# Altium project Hafez_Board.PrjPcb
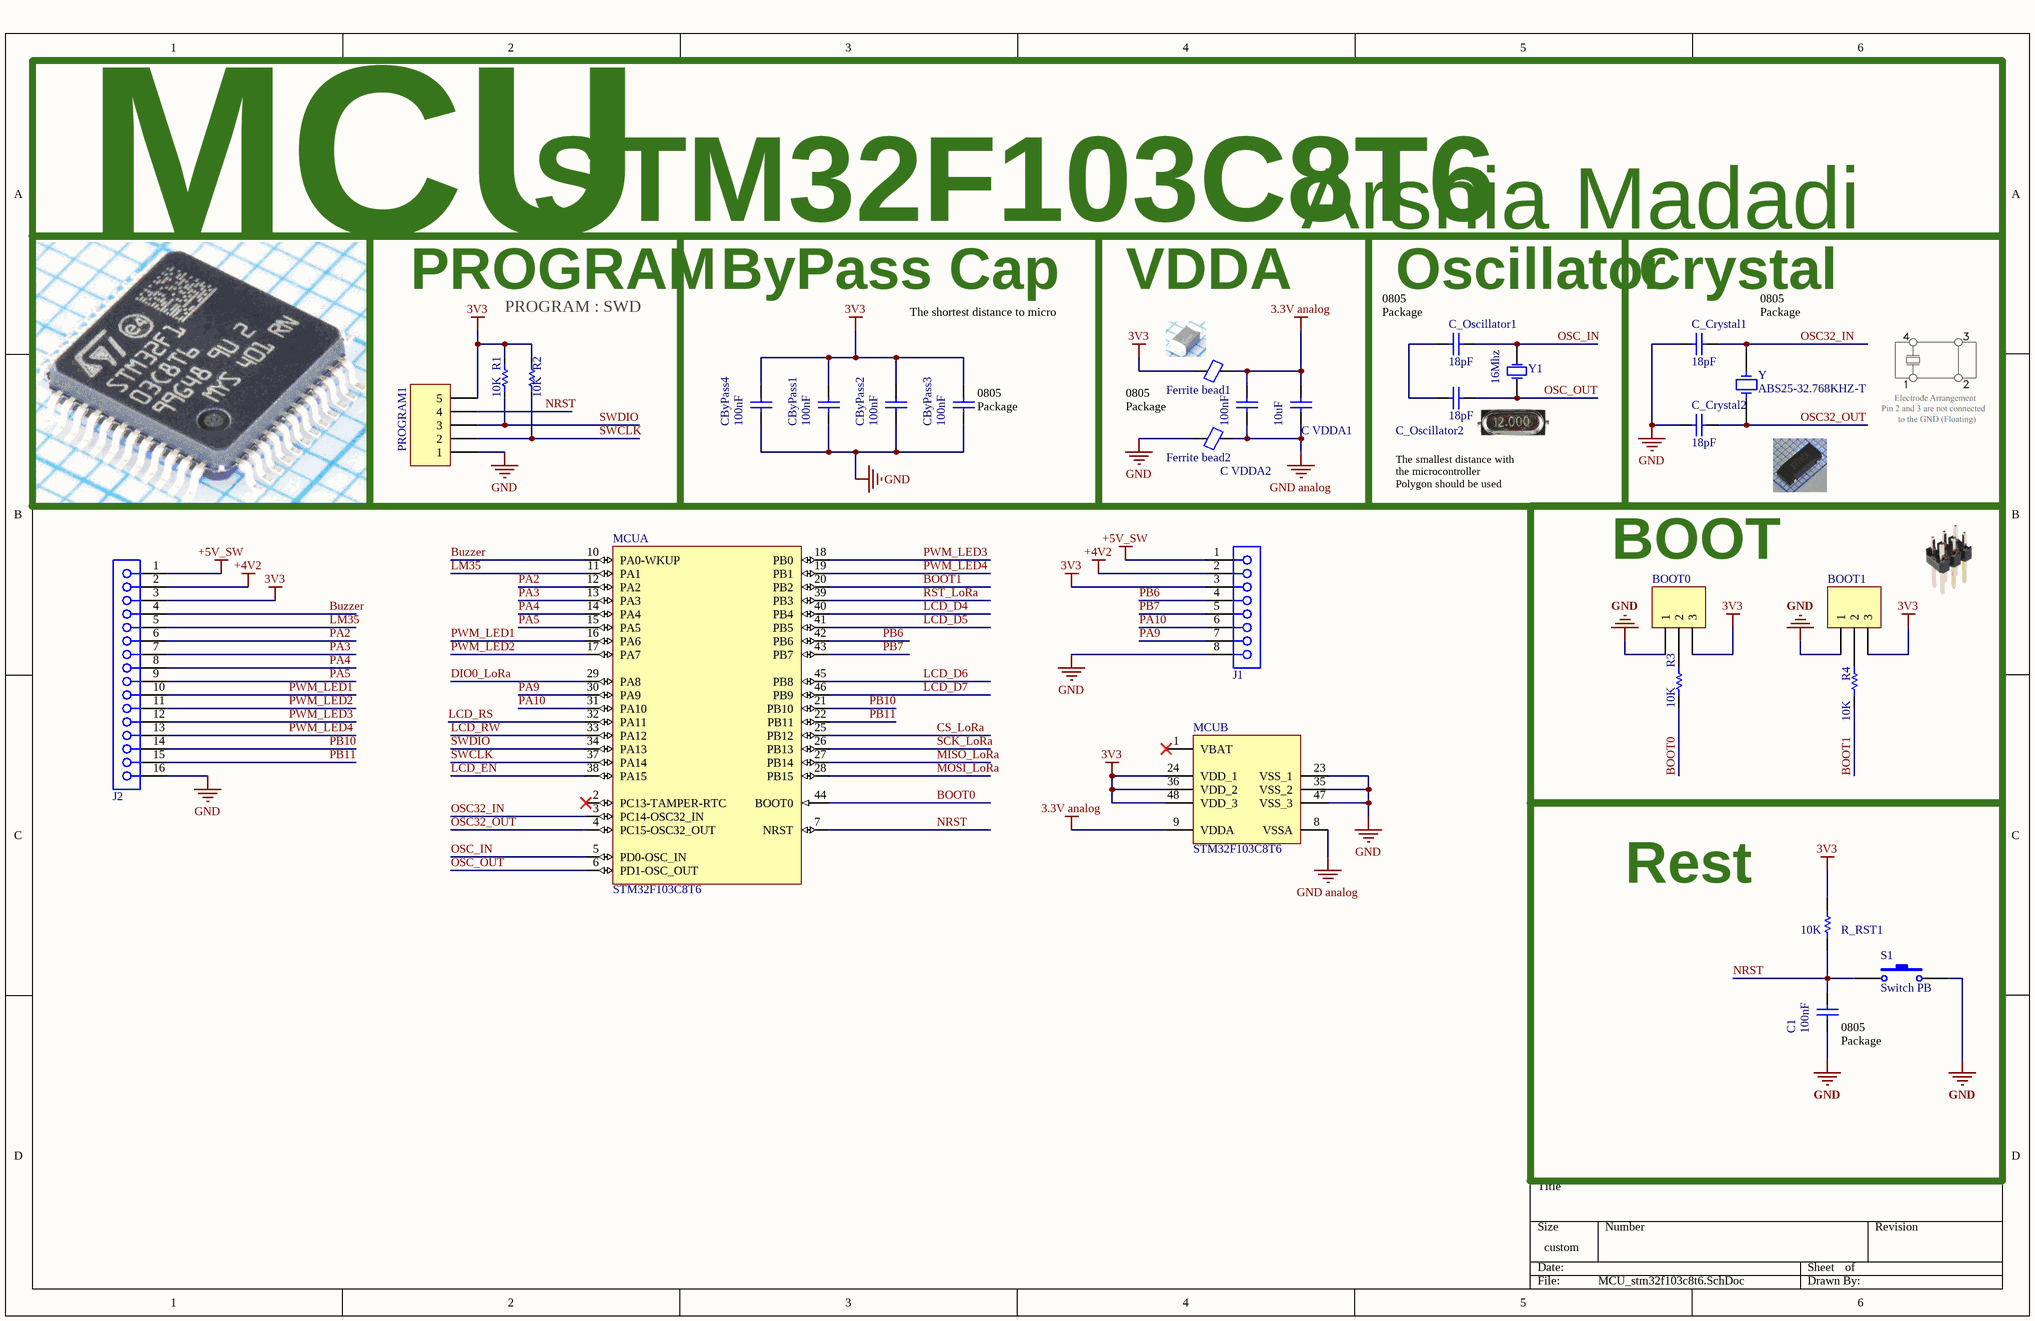
[diagram p0: MCU_stm32f103c8t6.SchDoc]
5 sheets, 81 parts. Net scope: global (net labels, ports and power ports of the same name join across sheets).
Board file: Hafez_PCB.PcbDoc
Sheets:
  MCU_stm32f103c8t6.SchDoc
  Power.SchDoc
  UI.SchDoc
  Communications_Chip.SchDoc
  ADC.SchDoc

## Sheet MCU_stm32f103c8t6.SchDoc
size 381 x 241 mm; SheetNumber: 1; SheetTotal: 5

### Parts
BOOT0  Header 3  [My_1X03]  (value not drawn)
BOOT1  Header 3  [My_1X03]  (value not drawn)
C1  100nF  [MY_CAP_SMD_0805]
C_Crystal1  18pF  [MY_CAP_SMD_0805]
C_Crystal2  18pF  [MY_CAP_SMD_0805]
C_Oscillator1  18pF  [MY_CAP_SMD_0805]
C_Oscillator2  18pF  [MY_CAP_SMD_0805]
C_VDDA1  10uF  [MY_CAP_SMD_0805]
C_VDDA2  100nF  [MY_CAP_SMD_0805]
CByPass1  100nF  [MY_CAP_SMD_0805]
CByPass2  100nF  [MY_CAP_SMD_0805]
CByPass3  100nF  [MY_CAP_SMD_0805]
CByPass4  100nF  [MY_CAP_SMD_0805]
Ferrite_bead1  Ferrite Bead SMD  [FB1206]  (value not drawn)
Ferrite_bead2  Ferrite Bead SMD  [FB1206]  (value not drawn)
J1  61300811821  [61300811821]  (value not drawn)
J2  61301611821  [61301611821]  (value not drawn)
MCU  STM32F103C8T6  [STM-LQFP48_M]  (parts A,B of 2)
PROGRAM1  Header 5  [My_1X05]  (value not drawn)
R1  10K  [1206_Res]
R2  10K  [1206_Res]
R3  10K  [RESC4817X04N]
R4  10K  [RESC4817X04N]
R_RST1  10K  [RESC4817X04N]
S1  Switch PB  [SW-PB]
Y  ABS25-32.768KHZ-T  [XTAL_ABS25-32.768KHZ-6-1-T]
Y1  16Mhz  [Crystal]

### Blocks framed on the sheet
MCU: C_Crystal1 C_Crystal2 C_Oscillator1 C_Oscillator2 C_VDDA1 C_VDDA2 CByPass1-CByPass4 Ferrite_bead1 Ferrite_bead2 PROGRAM1 R1 R2 Y Y1
BOOT: BOOT0 BOOT1 R3 R4
Rest: C1 R_RST1 S1

### Nets
3.3V analog: C_VDDA1.2 C_VDDA2.2 Ferrite_bead1.2 MCU.9(VDDA)
3V3: BOOT0.3 BOOT1.3 CByPass1.2 CByPass2.2 CByPass3.2 CByPass4.2 Ferrite_bead1.1 J1.3 J2.3 MCU.24(VDD_1) MCU.36(VDD_2) MCU.48(VDD_3) PROGRAM1.5 R1.2 R2.2 R_RST1.2
+4V2: J1.2 J2.2
+5V_SW: J1.1 J2.1
GND: BOOT0.1 BOOT1.1 C1.1 C_Crystal1.2 C_Crystal2.2 CByPass1.1 CByPass2.1 CByPass3.1 CByPass4.1 Ferrite_bead2.1 J1.8 J2.16 MCU.23(VSS_1) MCU.35(VSS_2) MCU.47(VSS_3) PROGRAM1.1 S1.2
GND analog: C_VDDA1.1 C_VDDA2.1 Ferrite_bead2.2 MCU.8(VSSA)
BOOT0: MCU.44(BOOT0) R3.1
BOOT1: MCU.20(PB2) R4.1
Buzzer: J2.4 MCU.10(PA0-WKUP)
CS_LoRa: MCU.25(PB12)
DIO0_LoRa: MCU.29(PA8)
LCD_D4: MCU.40(PB4)
LCD_D5: MCU.41(PB5)
LCD_D6: MCU.45(PB8)
LCD_D7: MCU.46(PB9)
LCD_EN: MCU.38(PA15)
LCD_RS: MCU.32(PA11)
LCD_RW: MCU.33(PA12)
LM35: J2.5 MCU.11(PA1)
MISO_LoRa: MCU.27(PB14)
MOSI_LoRa: MCU.28(PB15)
NRST: C1.2 MCU.7(NRST) PROGRAM1.4 R_RST1.1 S1.1
OSC32_IN: C_Crystal1.1 MCU.3(PC14-OSC32_IN) Y.4
OSC32_OUT: C_Crystal2.1 MCU.4(PC15-OSC32_OUT) Y.1
OSC_IN: C_Oscillator1.1 MCU.5(PD0-OSC_IN) Y1.2(OSC2)
OSC_OUT: C_Oscillator2.1 MCU.6(PD1-OSC_OUT) Y1.1(OSC1)
PA2: J2.6 MCU.12(PA2)
PA3: J2.7 MCU.13(PA3)
PA4: J2.8 MCU.14(PA4)
PA5: J2.9 MCU.15(PA5)
PA9: J1.7 MCU.30(PA9)
PA10: J1.6 MCU.31(PA10)
PB6: J1.4 MCU.42(PB6)
PB7: J1.5 MCU.43(PB7)
PB10: J2.14 MCU.21(PB10)
PB11: J2.15 MCU.22(PB11)
PWM_LED1: J2.10 MCU.16(PA6)
PWM_LED2: J2.11 MCU.17(PA7)
PWM_LED3: J2.12 MCU.18(PB0)
PWM_LED4: J2.13 MCU.19(PB1)
RST_LoRa: MCU.39(PB3)
SCK_LoRa: MCU.26(PB13)
SWCLK: MCU.37(PA14) PROGRAM1.2 R2.1
SWDIO: MCU.34(PA13) PROGRAM1.3 R1.1
NetBOOT0_2: BOOT0.2 R3.2
NetBOOT1_2: BOOT1.2 R4.2
NetC_Oscillator1_2: C_Oscillator1.2 C_Oscillator2.2

Not connected (* = marked no-connect by the designer): MCU 1(VBAT)* 2(PC13-TAMPER-RTC)*

### Notes on the sheet
- STM32F103C8T6
- Arshia Madadi
- PROGRAM
- PROGRAM : SWD
- ByPass Cap
- VDDA
- (near C_Oscillator1) 0805 Package
- Oscillator
- (near C_Crystal1) Crystal
- 0805 Package
- The shortest distance to micro
- (near CByPass3) 0805 Package
- The smallest distance with the microcontroller
  Polygon should be used
- (near C1) 0805 Package

### Library data of the parts
BOOT0 BOOT1 = Header 3: Header, 3-Pin; LatestRevisionDate: 17-Jul-2002; LatestRevisionNote: Re-released for DXP Platform.; Publisher: Altium Limited
C1 C_Crystal1 C_Crystal2 C_Oscillator1 C_Oscillator2 C_VDDA1 C_VDDA2 CByPass1-CByPass4 = CAP SMD_0805: 2.0 mm × 1.25 mm
Ferrite_bead1 Ferrite_bead2 = Ferrite Bead SMD Package: Designer: Ali Hafizi
J1 = 61300811821: WR-PHD Socket Header, THT, Vertical, pitch 2.54mm, 1 Row, 8P; Manufacturer: Wurth Elektronik; Contact Resistance: 20mOhm; Rated Current: 3A; Working Voltage: 250V; Withstanding Voltage: 500V; Manufacturer Part Number: 61300811821; Category: Board-to-Board Connectors; Match Code: WR-PHD; ComponentLink1Description: Website Link; ComponentLink1URL: https://www.we-online.com/redexpert/article/61300811821?ad; ComponentLink2Description: Datasheet Link; ComponentLink2URL: https://www.we-online.com/redexpert/spec/61300811821?ad; Mount: Through Hole; Operating Temperature Max: 125°C; Operating Temperature Min: -40°C; Packaging: Tray; Gender: Socket Header; Number of Pins: 8; Number of Rows: 1; Orientation: Vertical; Pitch: 2.54mm
J2 = 61301611821: WR-PHD Socket Header, THT, Vertical, pitch 2.54mm, 1 Row, 16P; Manufacturer: Wurth Elektronik; Contact Resistance: 20mOhm; Rated Current: 3A; Working Voltage: 250V; Withstanding Voltage: 500V; Manufacturer Part Number: 61301611821; Category: Board-to-Board Connectors; Match Code: WR-PHD; ComponentLink1Description: Website Link; ComponentLink1URL: https://www.we-online.com/redexpert/article/61301611821?ad; ComponentLink2Description: Datasheet Link; ComponentLink2URL: https://www.we-online.com/redexpert/spec/61301611821?ad; Mount: Through Hole; Operating Temperature Max: 105°C; Operating Temperature Min: -40°C; Packaging: Tray; Gender: Socket Header; Number of Pins: 16; Number of Rows: 1; Orientation: Vertical; Pitch: 2.54mm
MCU = STM32F103C8T6: ARM Cortex-M3 32-bit MCU, 64 KB Flash, 20 KB Internal RAM, 37 I/Os, 48-pin LQFP, -40 to 85 degC, Tray; A/D Converter: 2x12-bit (10 Channel); FLASH Size (Prog) (kB): 64; I/Os (High Current): 37; Internal RAM Size (kB): 20; Operating Frequency(F) (Processor speed) (MHz): 72; Supply Voltage(Vcc) min (V): 2; DatasheetVersion: Rev. 16; PackageVersion: Rev. 6, 06/2013; PackageReference: LQFP48; PackageDescription: 48-Pin Low Profile Quad Flat Package, 7 x 7 mm Body, 0.5 mm Pitch; Supplier 1: Digi-Key; Supplier Part Number 1: 497-6063-ND; Supplier 2: Farnell; Supplier Part Number 2: 1447637; Supplier 3: Newark; Supplier Part Number 3: 59M2182; Supplier 4: Newark; Supplier Part Number 4: 57P1222; Supplier 5: Mouser; Supplier Part Number 5: 511-STM32F103C8T6; Core: ARM Cortex-M3; Packing: Tray; Mounting Technology: Surface Mount; PartNumber: STM32F103C8T6; ComponentLink1Description: Manufacturer URL; ComponentLink1URL: http://www.st.com/web/en/home.html; ComponentLink2Description: Datasheet; ComponentLink2URL: http://www.st.com/st-web-ui/static/active/en/resource/technical/document/datasheet/CD00161566.pdf; ComponentLink3Description: Package Specification; ComponentLink3URL: http://www.st.com/st-web-ui/static/active/en/resource/technical/document/datasheet/DM00058181.pdf
PROGRAM1 = Header 5: Header, 5-Pin; LatestRevisionDate: 17-Jul-2002; LatestRevisionNote: Re-released for DXP Platform.; Publisher: Altium Limited
R1 R2 = Res: Resistor; Published: 8-Jun-2000; LatestRevisionDate: 17-Jul-2002; LatestRevisionNote: Re-released for DXP Platform.; PackageReference: AXIAL-0.3; Publisher: Altium Limited
R3 R4 R_RST1 = RES 1206 0.25W: RES 1206; Designer: Abbas Basereh; Desc.: RES SMD 1206; Data: 16-12-2016
S1 = Switch PB: Push Button Switch
Y = ABS25-32.768KHZ-T: 32.768kHz Â±20ppm Crystal 12.5pF 50 kOhms 4-SOJ, 5.50mm pitch; MF: Abracon LLC; Package: 4-4 Abracon LLC; MP: ABS25-32.768KHZ; Value: *; Availability: Unavailable; Price: None; SnapEDA_Link: https://www.snapeda.com/parts/ABS25-32.768KHZ/Abracon%20LLC/view-part/478888/?ref=snap
Y1 = XTAL: Crystal Oscillator; Published: 8-Jun-2000; LatestRevisionDate: 17-Jul-2002; LatestRevisionNote: Re-released for DXP Platform.; PackageReference: R38; Publisher: Altium Limited

## Sheet Power.SchDoc
size 381 x 241 mm; SheetNumber: 2; SheetTotal: 4
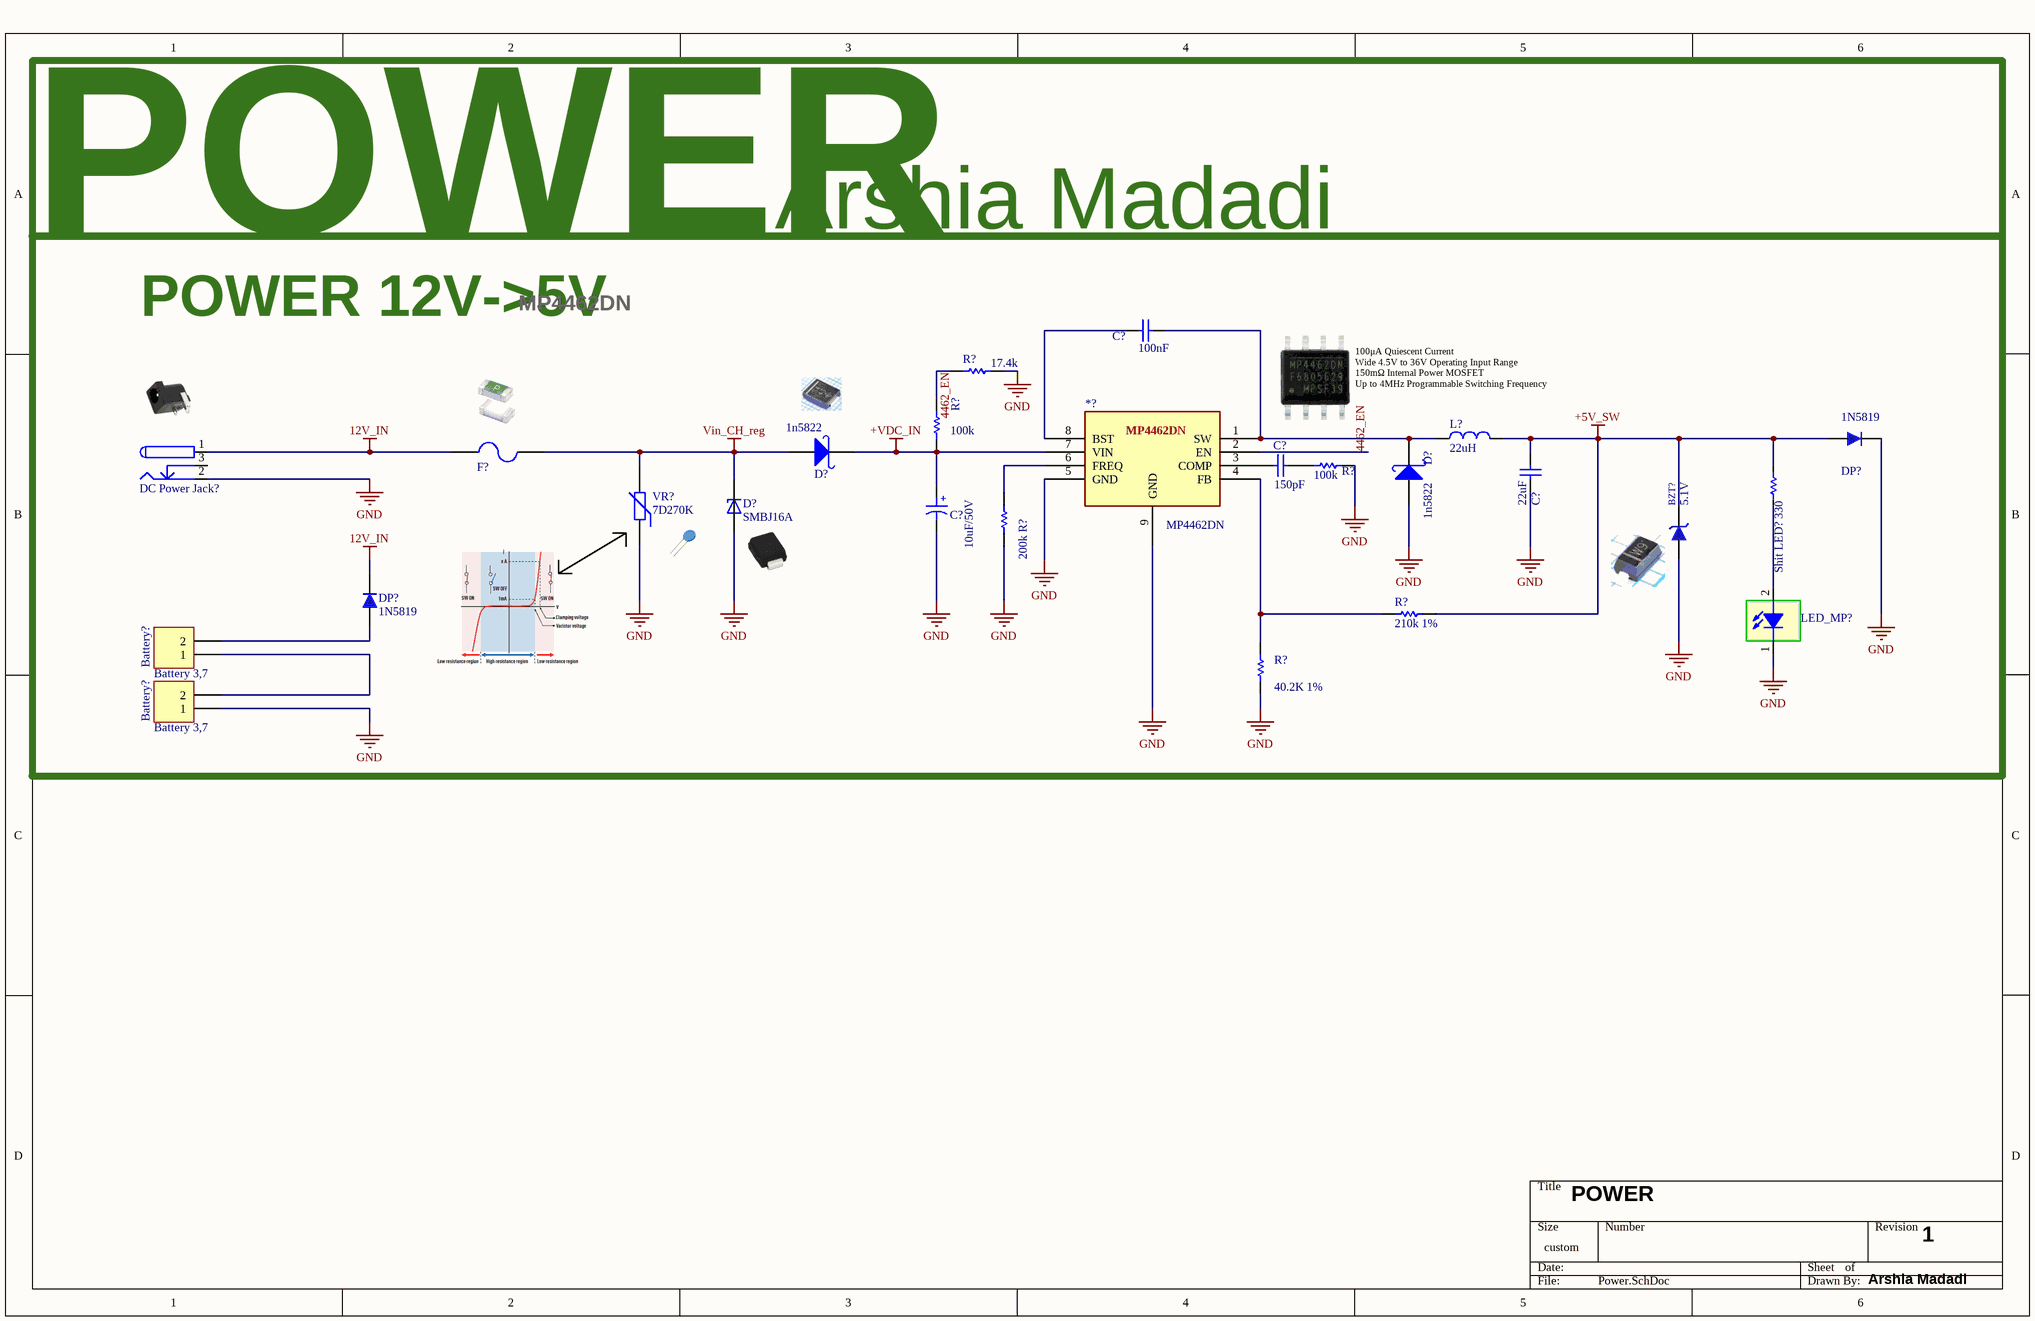
[diagram p1: Power.SchDoc]

### Parts
(Parts that share a designator on the sheet are numbered #1, #2 ... from top to bottom, then left to right.)
*?  MP4462DN  [PCBComponent_1 - duplicate]
Battery?#1  Battery 3,7  [HDR1X2]
Battery?#2  Battery 3,7  [HDR1X2]
BZT?  5.1V  [SOD123]
C?#1  100nF  [CAP1206]
C?#2  150pF  [CAP1206]
C?#3  22uF  [CAP1206]
C?#4  Part. No: 10uF/50V  [Cap electrolitic radial 10x20-5]  (hidden comment: Cap 10x21)
D?#1  1n5822  [DO-214AB(SMC)]
D?#2  1n5822  [DO-214AB(SMC)]
D?#3  SMBJ16A  [DIOM4336X265N]
DC_Power_Jack?  DC Power Jack  [DC Power Jack 1]  (value not drawn)
DP?#1  1N5819  [1n58XX DO-201AD]
DP?#2  1N5819  [1n58XX DO-201AD]
F?  F=3.0 A  [1206 FUSE]  (value not drawn)
L?  value 22uH  [0805 - big]  (hidden comment: 10uH)
LED_MP?  SMD 1206 LED  [LED 1206]  (value not drawn)
R?#1  17.4k  [RESC4817X04N]
R?#2  100k  [RESC4817X04N]
R?#3  100k  [RESC4817X04N]
R?#4  200k  [RESC4817X04N]
R?#5  210k 1%  [RESC4817X04N]
R?#6  40.2K 1%  [RESC4817X04N]
Shit_LED?  330  [1206_Res]
VR?  7D270K  [07D XXX]

### Nets
12V_IN: DC_Power_Jack?.1 DP?#2.2 F?.1
+5V_SW: BZT?.2 C?#3.1 DP?#1.1 L?.2 R?#5.2 Shit_LED?.2
+VDC_IN: *?.7(VIN) C?#4.1 D?#1.2(K) R?#2.2
GND: *?.5(GND) *?.9(GND) Battery?#2.1 BZT?.1 C?#3.2 C?#4.2 D?#2.1(A) D?#3.A DC_Power_Jack?.2 DP?#1.2 LED_MP?.1 R?#1.2 R?#3.2 R?#4.1 R?#6.1 VR?.1
Vin_CH_reg: D?#1.1(A) D?#3.C F?.2 VR?.2
4462_EN: *?.2(EN) R?#1.1 R?#2.1
Net*?_1: *?.1(SW) C?#1.1 D?#2.2(K) L?.1
Net*?_3: *?.3(COMP) C?#2.2
Net*?_4: *?.4(FB) R?#5.1 R?#6.2
Net*?_6: *?.6(FREQ) R?#4.2
Net*?_8: *?.8(BST) C?#1.2
NetBattery?#1_1: Battery?#1.1 Battery?#2.2
NetBattery?#1_2: Battery?#1.2 DP?#2.1
NetC?#2_1: C?#2.1 R?#3.1
NetLED_MP?_2: LED_MP?.2 Shit_LED?.1

Not connected (* = marked no-connect by the designer): DC_Power_Jack? 3

### Notes on the sheet
- Arshia Madadi
- POWER
- POWER 12V->5V
- MP4462DN
- (near L?) 100μA Quiescent Current
  Wide 4.5V to 36V Operating Input Range
  150mΩ Internal Power MOSFET
  Up to 4MHz Programmable Switching Frequency
- 1
- (in symbol Cap electrolitic radial 10x21) +

### Library data of the parts
Battery?#1 Battery?#2 = Header 2: Header, 2-Pin; LatestRevisionDate: 17-Jul-2002; LatestRevisionNote: Re-released for DXP Platform.; Publisher: Altium Limited
BZT? = ZENER GENERAL DIODE: DIODE ZENER GENERAL; VALUE: 12V; Published: 2017-1-12; PackageVersion: 2017-1-12; PackageReference: DO 35; Publisher: Abbas Basereh; PackageDescription: DIODE GEN ZENER; ComponentLink1Description: Manufacturer Link; ComponentLink2Description: Datasheet
C?#1 = CAP SMD PACKAGE: TOTAL CAPACITOR SMD PACK; Designer: Abbas Basereh; Desc.: CAP SMD TOTAL PACKAGES; Data: 2017-3-10; VALUE: 100nF
C?#2 C?#3 = CAP SMD PACKAGE: TOTAL CAPACITOR SMD PACK; Designer: Abbas Basereh; Desc.: CAP SMD TOTAL PACKAGES; VALUE: 100nF; Data: 2017-3-10
C?#4 = Cap electrolitic radial 10x21: Cap electrolitic radial; Designer: Abbas Basereh; Data: 16-12-2016
D?#1 D?#2 = 1N5822 SMD: Schottky Rectifiers; Part. No: SS34; Manufacturer: ON Semiconductor/Fairchild; Designer: Abbas Basereh; Link: https://www.aliexpress.com/item/Free-shipping-100pcs-1n5822-sma-smd-do-214ac-Schottky-diode-ss34/32337482329.html?spm=2114.01010208.3.1.zLZDsP&ws_ab_test=searchweb0_0,searchweb201602_4_10065_10068_10084_10083_10080_10082_10081_10060_10061_10062_10056_10055_10054_10059_10099_10078_10079_427_10073_10103_10102_10096_10052_10050_10051,searchweb201603_4&btsid=6e50dc92-ac69-45bc-a19e-209af19ce602; Link: http://www.tme.eu/en/details/ss34/smd-schottky-diodes/vishay/ss34-e357t/; Link: http://www.digikey.com/product-detail/en/on-semiconductor-fairchild/SS34/SS34FSCT-ND/2094459; Data: 16-12-2016
D?#3 = SMBJ16A: 600W, 18.8V, 5%, Unidirectional, TVS; MF: Taiwan Semiconductor; MP: SMBJ16A; SnapEDA_Link: https://www.snapeda.com/parts/SMBJ16A/Taiwan+Semiconductor/view-part/?ref=snap; Check_prices: https://www.snapeda.com/parts/SMBJ16A/Taiwan+Semiconductor/view-part/?ref=eda; Price: None; Availability: In Stock; Purchase-URL: https://pricing.snapeda.com/search/part/SMBJ16A/?ref=eda; Package: SMD-2-2 Avago; Value: *
DC_Power_Jack? = DC Power Jack: DC Power Jack. Center Pin 2.5mm. Diameter: 5.7mm; Designer: Ali Hafizi; Company: Personal; Project Name: Laser; Adding Date: 10/21/2009
DP?#1 DP?#2 = 1N5819: Schottkey Rectifiers; Designer: Abbas Basereh; Data: 16-12-2016; Link: *; Part. No: *
F? = Fuse SMD1206: SMD Fuses 1206; Designer: Abbas Basereh; Desc.: SMD Fuses 1206; Data: 16-12-2016
L? = Inductor: Code_IEC: 1005; Published: 8-Jun-2000; LatestRevisionDate: 17-Jul-2002; LatestRevisionNote: Re-released for DXP Platform.; PackageReference: 0402-A; Publisher: Altium Limited; Code_JEITA: 0402
LED_MP? = LED SMD 1206
R?#1-R?#6 = RES 1206 0.25W: as R3 on sheet MCU_stm32f103c8t6; Data: 16-12-2016
Shit_LED? = Res: Resistor; Published: 8-Jun-2000; LatestRevisionDate: 17-Jul-2002; LatestRevisionNote: Re-released for DXP Platform.; PackageReference: AXIAL-0.3; Publisher: Altium Limited
VR? = VARISTOR (VDR): VARISTORS; Manufacturer: china-canada-philipina; Designer: Abbas Basereh; VALUE: xxDxxx; Models: MOV-VDR-COV; Data: 2017-1-5; Link: digikey.com; PUBLISHER: ABBAS BASEREH

## Sheet UI.SchDoc
size A; SheetNumber: 3; SheetTotal: 5
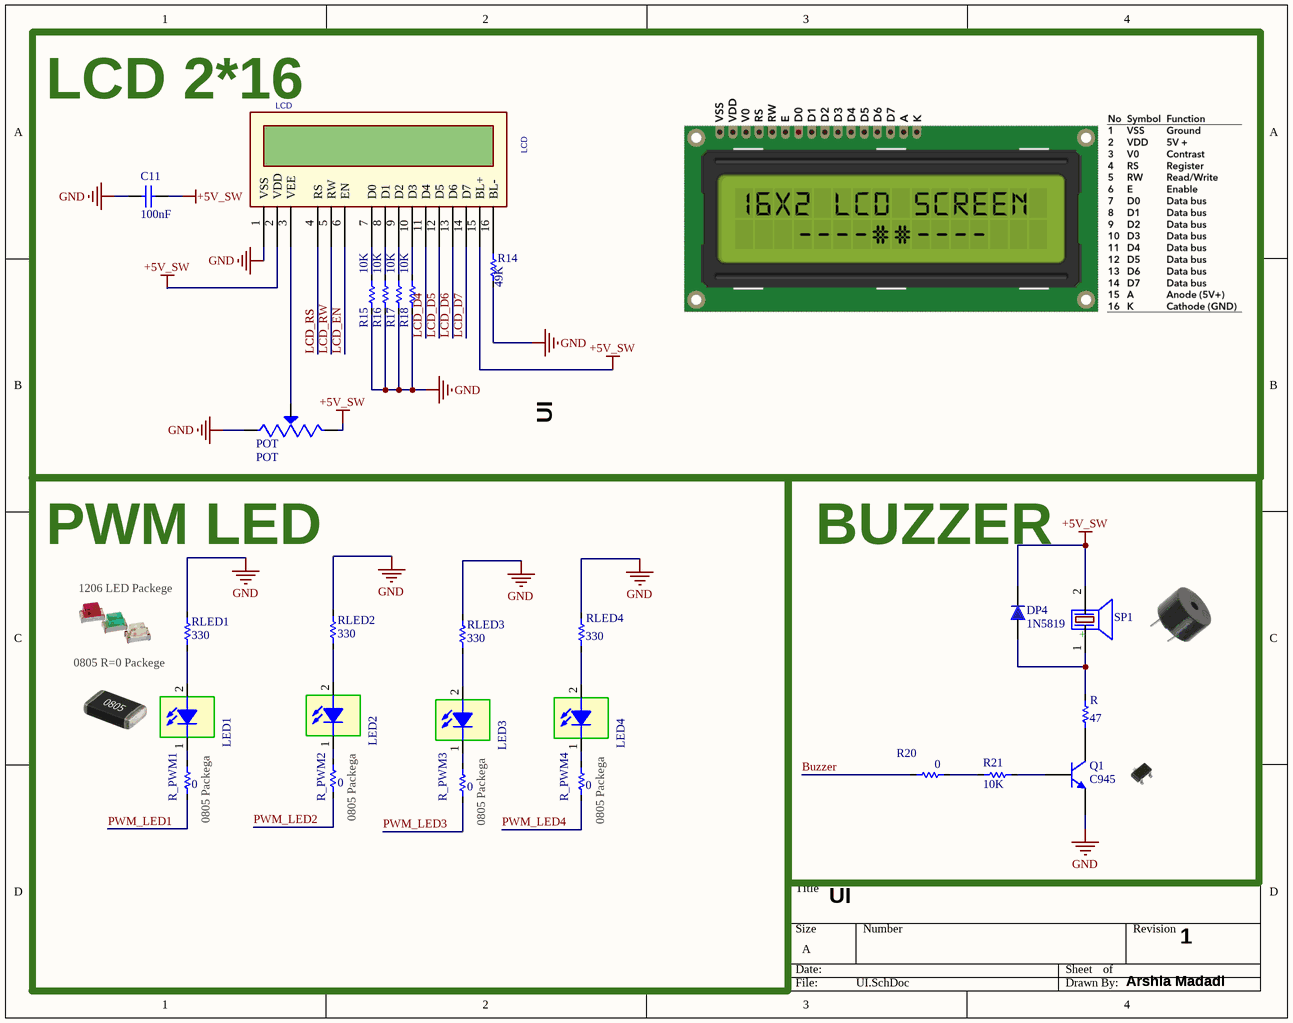
[diagram p2: UI.SchDoc]

### Parts
C11  100nF  [CAPC4817X12N]
DP4  1N5819  [430X270D]
LCD  LCD  [LCD_2X16 BLUE - 2.5mm]
LED1  SMD 1206 LED  [LED 1206]  (value not drawn)
LED2  SMD 1206 LED  [LED 1206]  (value not drawn)
LED3  SMD 1206 LED  [LED 1206]  (value not drawn)
LED4  SMD 1206 LED  [LED 1206]  (value not drawn)
POT  POT  [TRIM_3296W1103LF]
Q1  C945  [SOT23_M]
R  47  [1206_Res]
R14  49K  [1206_Res]
R15  10K  [1206_Res]
R16  10K  [1206_Res]
R17  10K  [1206_Res]
R18  10K  [1206_Res]
R20  0  [0805]
R21  10K  [1206_Res]
R_PWM1  0  [0805]
R_PWM2  0  [0805]
R_PWM3  0  [0805]
R_PWM4  0  [0805]
RLED1  330  [1206_Res]
RLED2  330  [1206_Res]
RLED3  330  [1206_Res]
RLED4  330  [1206_Res]
SP1  (no value)  [BUZZER 7.62mm DC]

### Blocks framed on the sheet
LCD 2*16: C11 LCD POT R14-R18
PWM LED: LED1-LED4 R_PWM1-R_PWM4 RLED1-RLED4
BUZZER: DP4 Q1 R R20 R21 SP1

### Nets
+5V_SW: C11.2 DP4.2 LCD.2(VDD) LCD.15(BL+) POT.3(CW) SP1.2(-)
GND: C11.1 LCD.1(VSS) POT.1(CCW) Q1.2(E) R14.2 R15.1 R16.1 R17.1 R18.1 RLED1.2 RLED2.2 RLED3.2 RLED4.2
Buzzer: R20.2
LCD_D4: LCD.11(D4)
LCD_D5: LCD.12(D5)
LCD_D6: LCD.13(D6)
LCD_D7: LCD.14(D7)
LCD_EN: LCD.6(EN)
LCD_RS: LCD.4(RS)
LCD_RW: LCD.5(RW)
PWM_LED1: R_PWM1.1
PWM_LED2: R_PWM2.1
PWM_LED3: R_PWM3.1
PWM_LED4: R_PWM4.1
NetDP4_1: DP4.1 R.2 SP1.1(+)
NetLCD_3: LCD.3(VEE) POT.2(WIPER)
NetLCD_7: LCD.7(D0) R15.2
NetLCD_8: LCD.8(D1) R16.2
NetLCD_9: LCD.9(D2) R17.2
NetLCD_10: LCD.10(D3) R18.2
NetLCD_16: LCD.16(BL-) R14.1
NetLED1_1: LED1.1 R_PWM1.2
NetLED1_2: LED1.2 RLED1.1
NetLED2_1: LED2.1 R_PWM2.2
NetLED2_2: LED2.2 RLED2.1
NetLED3_1: LED3.1 R_PWM3.2
NetLED3_2: LED3.2 RLED3.1
NetLED4_1: LED4.1 R_PWM4.2
NetLED4_2: LED4.2 RLED4.1
NetQ1_1: Q1.1(B) R21.1
NetQ1_3: Q1.3(C) R.1
NetR20_1: R20.1 R21.2

### Notes on the sheet
- UI
- (near RLED1) 1206 LED Packege
- 0805 R=0 Packege
- 0805 Packega
- 1
- Arshia Madadi

### Library data of the parts
C11 = CAP SMD 1206: CAP 1206; Designer: Abbas Basereh; Desc.: CAP SMD 1206; Data: 16-12-2016
DP4 = 1N5819: as DP?#1 on sheet Power; Data: 16-12-2016; Link: *; Part. No: *
LCD = LCD: Alphanumic LCD; Designer: Abbas Basereh; Data: 16-12-2016
LED1-LED4 = LED SMD 1206
POT = 3296W1103LF: Trimmer, Potentiometer 10kohm 25turn Thd; MF: Bourns; Package: None; MP: 3296W1103LF; Check_prices: https://www.snapeda.com/parts/3296W1103LF/Bourns/view-part/2487625/?ref=eda; Availability: Unavailable; Price: None; Value: *; SnapEDA_Link: https://www.snapeda.com/parts/3296W1103LF/Bourns/view-part/2487625/?ref=snap
Q1 = C945: NPN Silicon Epitaxial Planar Transistor; Published: 2017-2-8; LatestRevisionDate: 2017; LatestRevisionNote: IPC-7351 Footprint Added.; DatasheetVersion: 2017; PackageVersion: 2017-2-8; PackageReference: SOT23; Publisher: Abbas Basereh; PackageDescription: 3-Pin SOT-23 Package 0.95 mm Pitch, 2.3 mm Lead Span; ComponentLink1Description: Manufacturer Link; ComponentLink1URL: http://www.taitroncomponents.com/; ComponentLink2Description: Datasheet; ComponentLink2URL: http://www.taitroncomponents.com/
R R14-R18 R20 R21 R_PWM1-R_PWM4 RLED1-RLED4 = Res: Resistor; Published: 8-Jun-2000; LatestRevisionDate: 17-Jul-2002; LatestRevisionNote: Re-released for DXP Platform.; PackageReference: AXIAL-0.3; Publisher: Altium Limited
SP1 = PIEZO BUZZER: PIEZO BUZZER ACTIVE; Designer: Abbas Basereh; Comment_1: SPEAKER AND BEEP; Design Date: 1395/11/14; ComponentLink2Description: Reference; PackageDescription: THD; Publisher: Abbas Basereh; Mounting Technology: THD; Pin Count: 2; Status: Unreleased

## Sheet Communications_Chip.SchDoc
size A; SheetNumber: 4; SheetTotal: 5
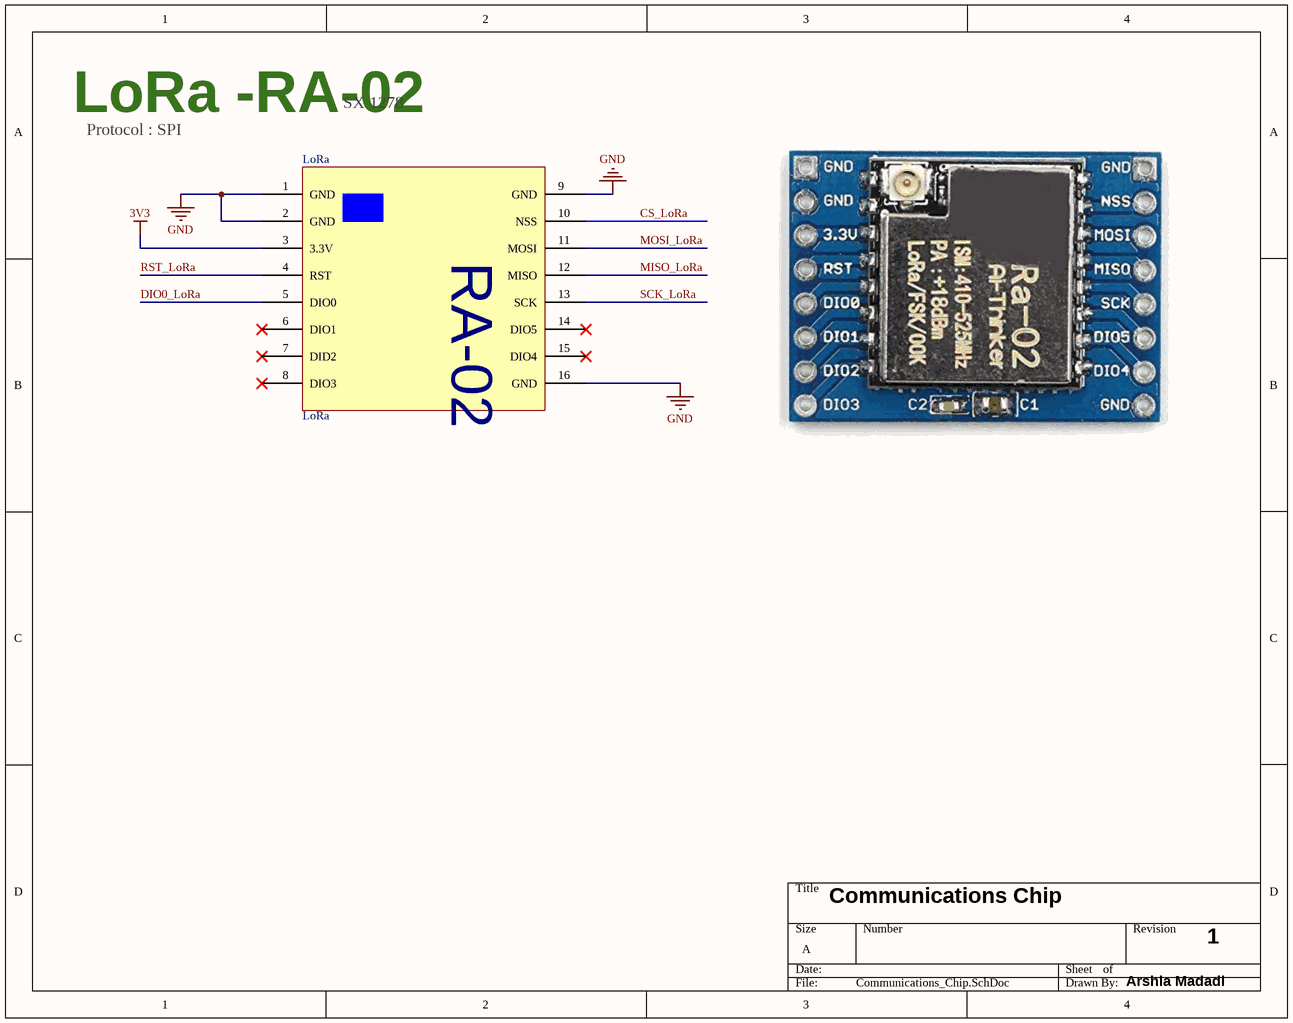
[diagram p3: Communications_Chip.SchDoc]

### Parts
LoRa  LoRa  [PCBComponent_1]

### Nets
3V3: LoRa.3(3.3V)
GND: LoRa.1(GND) LoRa.2(GND) LoRa.9(GND) LoRa.16(GND)
CS_LoRa: LoRa.10(NSS)
DIO0_LoRa: LoRa.5(DIO0)
MISO_LoRa: LoRa.12(MISO)
MOSI_LoRa: LoRa.11(MOSI)
RST_LoRa: LoRa.4(RST)
SCK_LoRa: LoRa.13(SCK)

Not connected (* = marked no-connect by the designer): LoRa 6(DIO1)* 7(DID2)* 8(DIO3)* 14(DIO5)* 15(DIO4)*

### Notes on the sheet
- LoRa -RA-02
- Protocol : SPI
- SX 1278
- Communications Chip
- 1
- Arshia Madadi
- (in symbol LoRa) RA-02

## Sheet ADC.SchDoc
size A; SheetNumber: 5; SheetTotal: 5
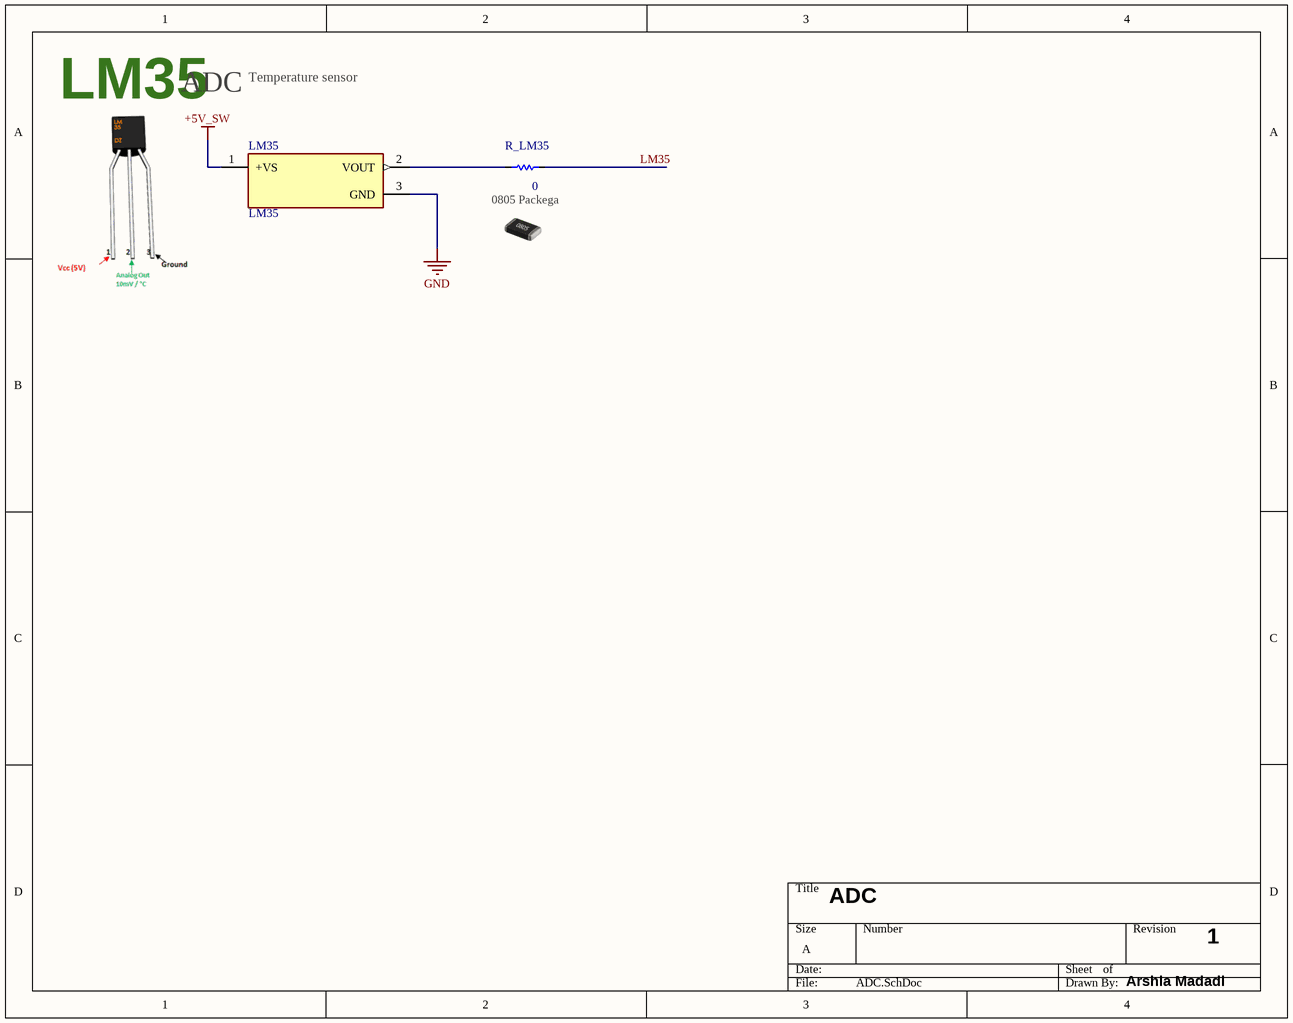
[diagram p4: ADC.SchDoc]

### Parts
LM35  LM35  [TO92127P521H735-3]
R_LM35  0  [0805]

### Nets
+5V_SW: LM35.1(+VS)
GND: LM35.3(GND)
LM35: R_LM35.2
NetLM35_2: LM35.2(VOUT) R_LM35.1

### Notes on the sheet
- ADC
- Temperature sensor
- LM35
- (near R_LM35) 0805 Packega
- 1
- Arshia Madadi

### Library data of the parts
LM35 = LM35DZ/NOPB: Temperature Sensor Analog, Local 0Â°C ~ 100Â°C 10mV/Â°C TO-92-3; MP: LM35DZ; MF: Texas Instruments; Price: None; Availability: In Stock; Package: E-PKG AXIAL-LEADED-2 ON Semiconductor; Value: *; SnapEDA_Link: https://www.snapeda.com/parts/LM35DZ/Texas+Instruments/view-part/?ref=snap; Purchase-URL: https://pricing.snapeda.com/search/part/LM35DZ/?ref=eda; Check_prices: https://www.snapeda.com/parts/LM35DZ/Texas+Instruments/view-part/?ref=eda
R_LM35 = Res: Resistor; Published: 8-Jun-2000; LatestRevisionDate: 17-Jul-2002; LatestRevisionNote: Re-released for DXP Platform.; PackageReference: AXIAL-0.3; Publisher: Altium Limited

## Nets that join several sheets
3V3: MCU_stm32f103c8t6 (16 pins), Communications_Chip (LoRa.3)
+5V_SW: MCU_stm32f103c8t6 (J1.1 J2.1), Power (6 pins), UI (6 pins), ADC (LM35.1)
GND: MCU_stm32f103c8t6 (17 pins), Power (16 pins), UI (13 pins), Communications_Chip (LoRa.1 LoRa.2 LoRa.9 LoRa.16), ADC (LM35.3)
Buzzer: MCU_stm32f103c8t6 (J2.4 MCU.10), UI (R20.2)
CS_LoRa: MCU_stm32f103c8t6 (MCU.25), Communications_Chip (LoRa.10)
DIO0_LoRa: MCU_stm32f103c8t6 (MCU.29), Communications_Chip (LoRa.5)
LCD_D4: MCU_stm32f103c8t6 (MCU.40), UI (LCD.11)
LCD_D5: MCU_stm32f103c8t6 (MCU.41), UI (LCD.12)
LCD_D6: MCU_stm32f103c8t6 (MCU.45), UI (LCD.13)
LCD_D7: MCU_stm32f103c8t6 (MCU.46), UI (LCD.14)
LCD_EN: MCU_stm32f103c8t6 (MCU.38), UI (LCD.6)
LCD_RS: MCU_stm32f103c8t6 (MCU.32), UI (LCD.4)
LCD_RW: MCU_stm32f103c8t6 (MCU.33), UI (LCD.5)
LM35: MCU_stm32f103c8t6 (J2.5 MCU.11), ADC (R_LM35.2)
MISO_LoRa: MCU_stm32f103c8t6 (MCU.27), Communications_Chip (LoRa.12)
MOSI_LoRa: MCU_stm32f103c8t6 (MCU.28), Communications_Chip (LoRa.11)
PWM_LED1: MCU_stm32f103c8t6 (J2.10 MCU.16), UI (R_PWM1.1)
PWM_LED2: MCU_stm32f103c8t6 (J2.11 MCU.17), UI (R_PWM2.1)
PWM_LED3: MCU_stm32f103c8t6 (J2.12 MCU.18), UI (R_PWM3.1)
PWM_LED4: MCU_stm32f103c8t6 (J2.13 MCU.19), UI (R_PWM4.1)
RST_LoRa: MCU_stm32f103c8t6 (MCU.39), Communications_Chip (LoRa.4)
SCK_LoRa: MCU_stm32f103c8t6 (MCU.26), Communications_Chip (LoRa.13)